# Altium schematic sheet CurrentVoltageMeasurement.SchDoc: MSE - CSYEI : Power stage
size A3; Author: Guillaume Volery; SheetNumber: 7; SheetTotal: 8; SVN: OUI; Version: 2.1; NoProject: <no>; TitleProject: <project>
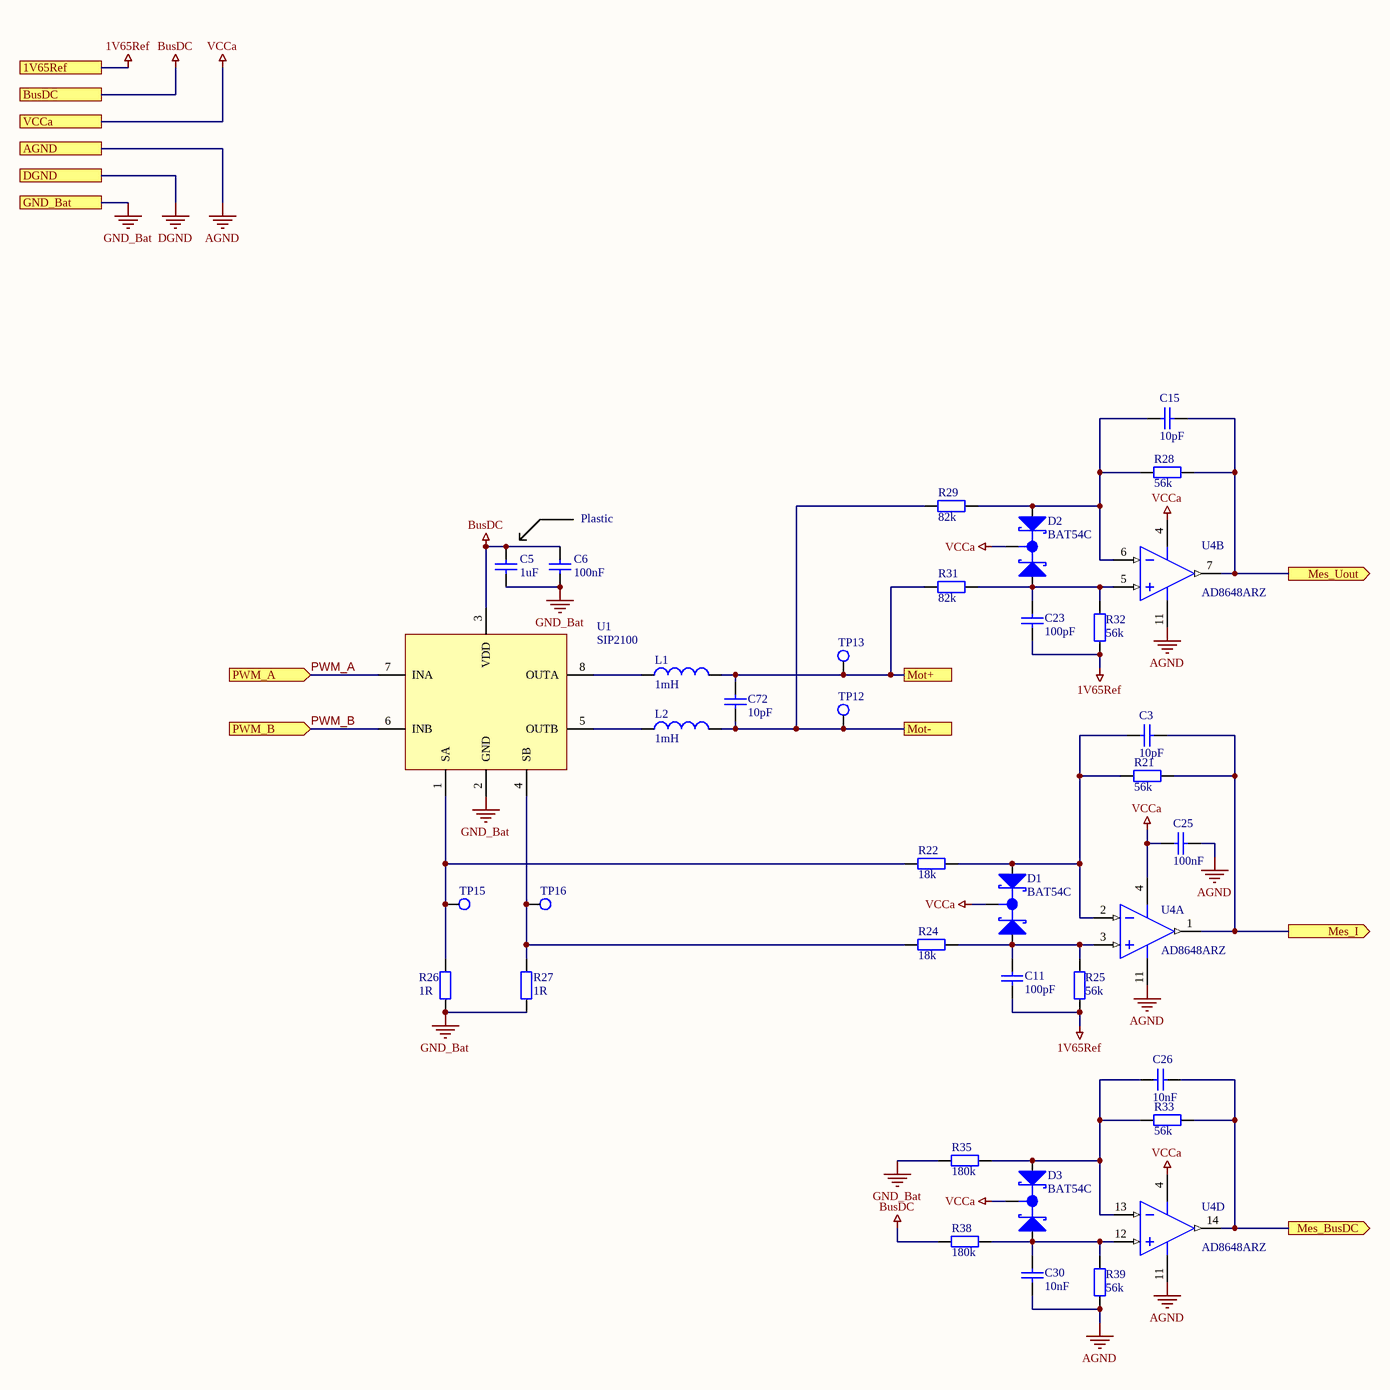
[diagram p0: CurrentVoltageMeasurement.SchDoc]

## Parts
C3  10pF  [CAPC2012N]
C5  1uF  [CAP2824]
C6  100nF  [CAPC2012N]
C11  100pF  [CAPC2012N]
C15  10pF  [CAPC2012N]
C23  100pF  [CAPC2012N]
C25  100nF  [CAPC2012N]
C26  10nF  [CAPC2012N]
C30  10nF  [CAPC2012N]
C72  10pF  [CAPC2012N]
D1  BAT54C  [SOT23-3N]
D2  BAT54C  [SOT23-3N]
D3  BAT54C  [SOT23-3N]
L1  1mH  [B82477G4]
L2  1mH  [B82477G4]
R21  56k  [RESC2012N]
R22  18k  [RESC2012N]
R24  18k  [RESC2012N]
R25  56k  [RESC2012N]
R26  1R  [RESC2012N]
R27  1R  [RESC2012N]
R28  56k  [RESC2012N]
R29  82k  [RESC2012N]
R31  82k  [RESC2012N]
R32  56k  [RESC2012N]
R33  56k  [RESC2012N]
R35  180k  [RESC2012N]
R38  180k  [RESC2012N]
R39  56k  [RESC2012N]
TP12  TP  [Testpoint]  (value not drawn)
TP13  TP  [Testpoint]  (value not drawn)
TP15  TP  [Testpoint]  (value not drawn)
TP16  TP  [Testpoint]  (value not drawn)
U1  SIP2100  [SOIC8]
U4  AD8648ARZ  [ADI-R-14_M]  (parts A,B,D of 4)

## Ports
1V65Ref, AGND, BusDC, DGND, GND_Bat, Mes_BusDC (out), Mes_I (out), Mes_Uout (out), Mot+, Mot-, PWM_A (in), PWM_B (in), VCCa

## Nets
1V65Ref: C11.1 C23.1 R25.1 R32.1 ; port 1V65Ref
AGND: C25.2 C30.1 R39.1 U4.11(-V) ; port AGND
BusDC: C5.2 C6.2 R38.2 U1.3(VDD) ; port BusDC
DGND: port DGND
GND_Bat: C5.1 C6.1 R26.1 R27.1 R35.2 U1.2(GND) ; port GND_Bat
VCCa: C25.1 D1.3(K) D2.3(K) D3.3(K) U4.4(+V) ; port VCCa
Mes_BusDC: C26.2 R33.1 U4.14(OUT_D) ; port Mes_BusDC
Mes_I: C3.1 R21.1 U4.1(OUT_A) ; port Mes_I
Mes_Uout: C15.1 R28.1 U4.7(OUT_B) ; port Mes_Uout
Mot+: C72.2 L1.2 R31.2 TP13.1 ; port Mot+
Mot-: C72.1 L2.2 R29.2 TP12.1 ; port Mot-
PWM_A: U1.7(INA) ; port PWM_A
PWM_B: U1.6(INB) ; port PWM_B
NetC3_2: C3.2 D1.1(A1) R21.2 R22.1 U4.2(-IN_A)
NetC11_2: C11.2 D1.2(A2) R24.1 R25.2 U4.3(+IN_A)
NetC15_2: C15.2 D2.1(A1) R28.2 R29.1 U4.6(-IN_B)
NetC23_2: C23.2 D2.2(A2) R31.1 R32.2 U4.5(+IN_B)
NetC26_1: C26.1 D3.1(A1) R33.2 R35.1 U4.13(-IN_D)
NetC30_2: C30.2 D3.2(A2) R38.1 R39.2 U4.12(+IN_D)
NetL1_1: L1.1 U1.8(OUTA)
NetL2_1: L2.1 U1.5(OUTB)
NetR22_2: R22.2 R26.2 TP15.1 U1.1(SA)
NetR24_2: R24.2 R27.2 TP16.1 U1.4(SB)

## Notes on the sheet
- (near C6) Plastic
- Title
- Institut d'automatisation industrielle
  rte de Cheseaux 1
  CH-1401 Yverdon-les-Bains
  T +41(0)24 55 77 377    F +41(0)24 55 76 320
  http://iai.heig-vd.ch       iai@heig-vd.ch
- Date:
- Size:
- A3
- Project:
- Sheet
- of
- No.
- Author:
- SVN
- Version
- File:

## Library data of the parts
C3 C15 C72 = Cap_10pF: Capacitor; Value: 10pF; Supplier 1: Digi-Key; Supplier Part Number 1: 311-1099-1-ND
C5 = Cap_1uF_Plastic: Capacitor; Value: 1uF; Supplier 1: Digi-Key; Supplier Part Number 1: 399-6416-1-ND
C6 C25 = Cap_100nF: Capacitor; Value: 100nF; Supplier 1: Digi-Key; Supplier Part Number 1: 478-1395-1-ND
C11 C23 = Cap_100pF: Capacitor; Value: 100pF; Supplier 1: Digi-Key; Supplier Part Number 1: 399-1122-1-ND
C26 C30 = Cap_10nF: Capacitor; Value: 10nF; Supplier 1: Digi-Key; Supplier Part Number 1: 311-1136-1-ND
L1 L2 = B82477G4105M: Supplier 1: Digi-Key; Supplier Part Number 1: 495-1820-1-ND; Value: 1mH
R21 R25 R28 R32 R33 R39 = Res_56k: Resistor; Value: 56k; Supplier 1: Digi-Key; Supplier Part Number 1: 311-56.0KCRCT-ND
R22 R24 = Res_18k: Resistor; Value: 18k; Supplier 1: Digi-Key; Supplier Part Number 1: 311-18.0KCRCT-ND
R26 R27 = Res_1R: Resistor; Value: 1R; Supplier 1: Digi-Key; Supplier Part Number 1: CRT0805-CY-1R00ELFCT-ND
R29 R31 = Res_82k: Resistor; Value: 82k; Supplier 1: Digi-Key; Supplier Part Number 1: 311-82.0KCRCT-ND
R35 R38 = Res_180k: Resistor; Value: 180k; Supplier 1: Digi-Key; Supplier Part Number 1: 311-180KCRCT-ND
TP12 TP13 TP15 TP16 = TP: =Value; Supplier 1: Digi-Key; Supplier Part Number 1: 36-5006-ND
U4 = AD8648ARZ: Quad Channel Wide Bandwidth Operational Amplifier, 22 MHz BW, 12 V/us SR, Industrial, 14-pin SOIC (R-14), Tube; Generic Part Number: AD8648; Manufacturer: Analog Devices; Amplifiers Per Package: 4; Automotive Qualified: Yes; Input Bias Current: 200fA; Input Offset Voltage: 700uV; Iq/Amp: 2mA; Slew Rate: 12V/us; Small Signal Bandwidth: 22MHz; V Span Max: 5.5V; V Span Min: 2.7V; DatasheetVersion: Rev. D; PackageVersion: 060606-A; PackageReference: R-14; PackageDescription: 14-Pin Standard Small Outline Package, Body 8.65 x 3.9 mm, Pitch 1.27 mm; Mounting Technology: Surface Mount; Code_JEDEC: MS-012-AB; PartNumber: AD8648ARZ; ComponentLink1Description: Manufacturer URL; ComponentLink1URL: http://www.analog.com/en/index.html; ComponentLink2Description: Datasheet; ComponentLink2URL: http://www.analog.com/static/imported-files/data_sheets/AD8646_8647_8648.pdf; ComponentLink3Description: Package Specification; ComponentLink3URL: http://www.analog.com/static/imported-files/packages/PKG_PDF/SOIC_Narrow%20(R)/R_14.pdf; Supplier 1: Digi-Key; Supplier Part Number 1: AD8648ARZ-ND
D1-D3 = BAT54C: Supplier 1: Digi-Key; Supplier Part Number 1: BAT54CLT1GOSCT-ND
U1 = SIP2100: Supplier 1: Digi-Key; Supplier Part Number 1: SIP2100DY-T1-GE3CT-ND